# EAGLE design 6N137 (EAGLE 6.5.0)
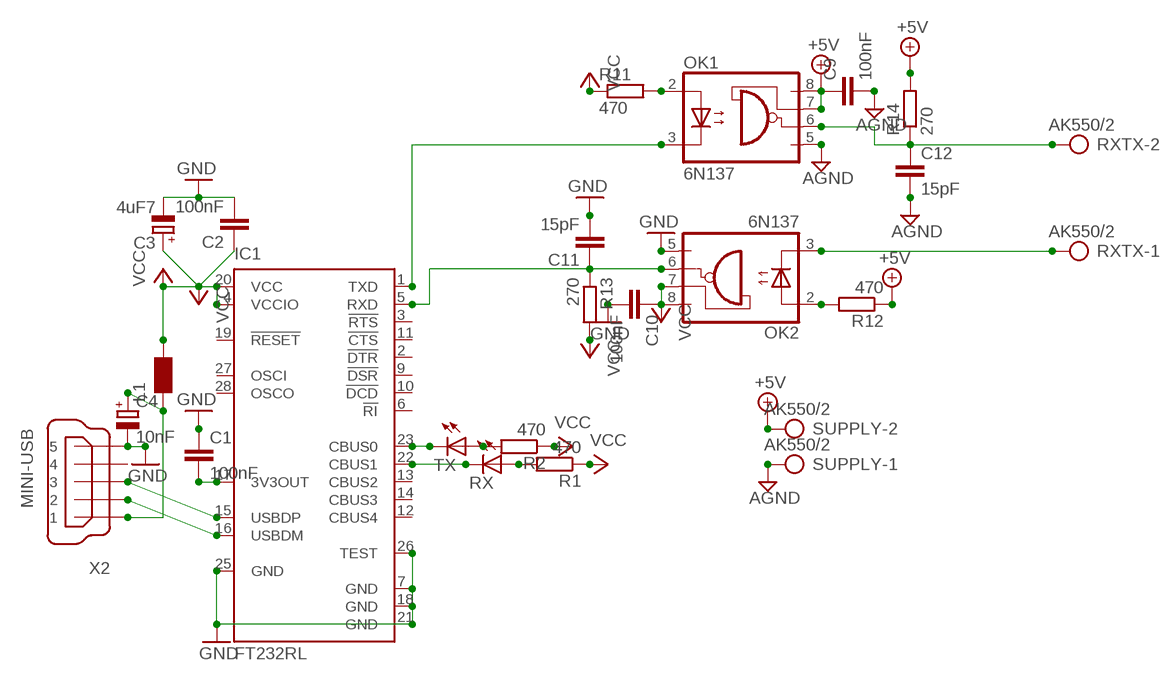
[diagram p0: schematic, sheet 1]

## Parts
C1  100nF  C-EUC1206K  [C1206K]
C2  100nF  C-EUC1206K  [C1206K]
C3  4uF7  CPOL-EU153CLV-0605  [153CLV-0605]
C4  10nF  CPOL-EU153CLV-0405  [153CLV-0405]
C9  100nF  C-EUC1206  [C1206]
C10  100nF  C-EUC1206  [C1206]
C11  15pF  C-EUC1206  [C1206]
C12  15pF  C-EUC1206  [C1206]
IC1  FT232RL  [SSOP28]
L1  WE-CBF_1206  [1206]
OK1  6N137  [DIL08]
OK2  6N137  [DIL08]
R1  470  R-EU_M1206  [M1206]
R2  470  R-EU_M1206  [M1206]
R11  470  R-EU_R1206  [R1206]
R12  470  R-EU_R1206  [R1206]
R13  270  R-EU_R1206  [R1206]
R14  270  R-EU_R1206  [R1206]
RX  LEDCHIPLED_1206  [CHIPLED_1206]
RXTX  AK550/2  [AK550/2]
SUPPLY  AK550/2  [AK550/2]
TX  LEDCHIPLED_1206  [CHIPLED_1206]
X2  MINI-USB  MINI-USB-SHIELD-UX60A-MB-5ST  [UX60A-MB-5ST]

## Nets
+5V: C9.1 OK1.7(VE) OK1.8(VCC) R12.1 R14.2 SUPPLY.2
AGND: C9.2 C12.2 OK1.5(GND) SUPPLY.1
FT_RXD1: C12.1 OK1.6(VO) R14.1 RXTX.2
FT_TXD1: OK2.3(C) RXTX.1
GND: C1.1 C2.2 C3.- C4.- C10.2 C11.2 IC1.7(GND) IC1.18(GND) IC1.21(GND) IC1.25(GND) IC1.26(TEST) OK2.5(GND) X2.5
N$1: IC1.16(USBDM) X2.2
N$2: IC1.15(USBDP) X2.3
N$3: R2.2 TX.A
N$5: C1.2 IC1.17(3V3OUT)
N$6: R1.2 RX.A
N$7: IC1.23(CBUS0) TX.C
N$8: IC1.22(CBUS1) RX.C
N$13: OK1.2(A) R11.2
N$16: OK2.2(A) R12.2
RXD1: C11.1 IC1.5(RXD) OK2.6(VO) R13.1
TXD1: IC1.1(TXD) OK1.3(C)
VBUS: C4.+ L1.1 X2.1
VCC: C2.1 C3.+ C10.1 IC1.4(VCCIO) IC1.20(VCC) L1.2 OK2.7(VE) OK2.8(VCC) R1.1 R2.1 R11.1 R13.2
Unconnected: IC1.2(!DTR) IC1.3(!RTS) IC1.6(!RI) IC1.9(!DSR) IC1.10(!DCD) IC1.11(!CTS) IC1.12(CBUS4) IC1.13(CBUS2) IC1.14(CBUS3) IC1.19(!RESET) IC1.27(OSCI) IC1.28(OSCO) X2.4 X2.M1(S1) X2.M2(S2) X2.M3(S3) X2.M4(S4)

## Library data of the parts
C1 C2 C9-C12 = rcl:C-EU: CAPACITOR, European symbol
C3 C4 = rcl:CPOL-EU: POLARIZED CAPACITOR, European symbol
IC1 = ftdichip:FT232R: Source: http://www.ftdichip.com/Documents/DataSheets/DS_FT232R_v104.pdf
L1 = wuerth-elektronik:WE-CBF: SMD EMI Suppression Ferrite Beads - excellent anti-EMI properties - low DCR - impedances till 3000 ohms - rated current up to 6 A
OK1 OK2 = optocoupler:6N137: MOTOROLA OPTO COUPLER; MPN: 6N137; OC_FARNELL: 1328376; OC_NEWARK: 52M1895
R1 R2 = resistor:R-EU_: RESISTOR, European symbol
R11-R14 = rcl:R-EU_: RESISTOR, European symbol
RX TX = led:LED: LED OSRAM: - CHIPLED LG R971, LG N971, LY N971, LG Q971, LY Q971, LO R971, LY R971 LH N974, LH R974 LS Q976, LO Q976, LY Q976 LO Q996 - Hyper CHIPLED LW Q18S LB Q993, LB Q99A, LB R99A - SideLED LS A670, LO A670, LY A670, LG A670, LP A670 LB A673, LV A673, LT A673, LW A673 LH A674 LY A675 LS A676, LA A676, LO A676, LY A676, LW A676 LS A679, LY A679, LG A679 - Hyper Micro SIDELED® LS Y876, LA Y876, LO Y876, LY Y876 LT Y87S - SmartLED LW L88C, LW L88S LB L89C, LB L89S, LG L890 LS L89K, LO L89K, LY L89K LS L896, LA L896, LO L896, LY L896 - TOPLED LS T670, LO T670, LY T670, LG T670, LP T670 LSG T670, LSP T670, LSY T670, LOP T670, LYG T670 LG T671, LOG T671, LSG T671 LB T673, LV T673, LT T673, LW T673 LH T674 LS T676, LA T676, LO T676, LY T676, LB T676, LH T676, LSB T676, LW T676 LB T67C, LV T67C, LT T67C, LS T67K, LO T67K, LY T67K, LW E67C LS E67B, LA E67B, LO E67B, LY E67B, LB E67C, LV E67C, LT E67C LW T67C LS T679, LY T679, LG T679 LS T770, LO T770, LY T770, LG T770, LP T770 LB T773, LV T773, LT T773, LW T773 LH T774 LS E675, LA E675, LY E675, LS T675 LS T776, LA T776, LO T776, LY T776, LB T776 LHGB T686 LT T68C, LB T68C - Hyper Mini TOPLED® LB M676 - Mini TOPLED Santana® LG M470 LS M47K, LO M47K, LY M47K Source: http://www.osram.convergy.de - LUMILED® LXK2-PW12-R00, LXK2-PW12-S00, LXK2-PW14-U00, LXK2-PW14-V00 LXK2-PM12-R00, LXK2-PM12-S00, LXK2-PM14-U00 LXK2-PE12-Q00, LXK2-PE12-R00, LXK2-PE12-S00, LXK2-PE14-T00, LXK2-PE14-U00 LXK2-PB12-K00, LXK2-PB12-L00, LXK2-PB12-M00, LXK2-PB14-N00, LXK2-PB14-P00, LXK2-PB14-Q00 LXK2-PR12-L00, LXK2-PR12-M00, LXK2-PR14-Q00, LXK2-PR14-R00 LXK2-PD12-Q00, LXK2-PD12-R00, LXK2-PD12-S00 LXK2-PH12-R00, LXK2-PH12-S00 LXK2-PL12-P00, LXK2-PL12-Q00, LXK2-PL12-R00 Source: www.luxeon.com
RXTX SUPPLY = con-ptr500:AK550/2: CONNECTOR
X2 = con-hirose:MINI-USB-SHIELD-: MINI USB Connector Source: http://www.hirose.co.jp/cataloge_hp/e24000019.pdf

## Board
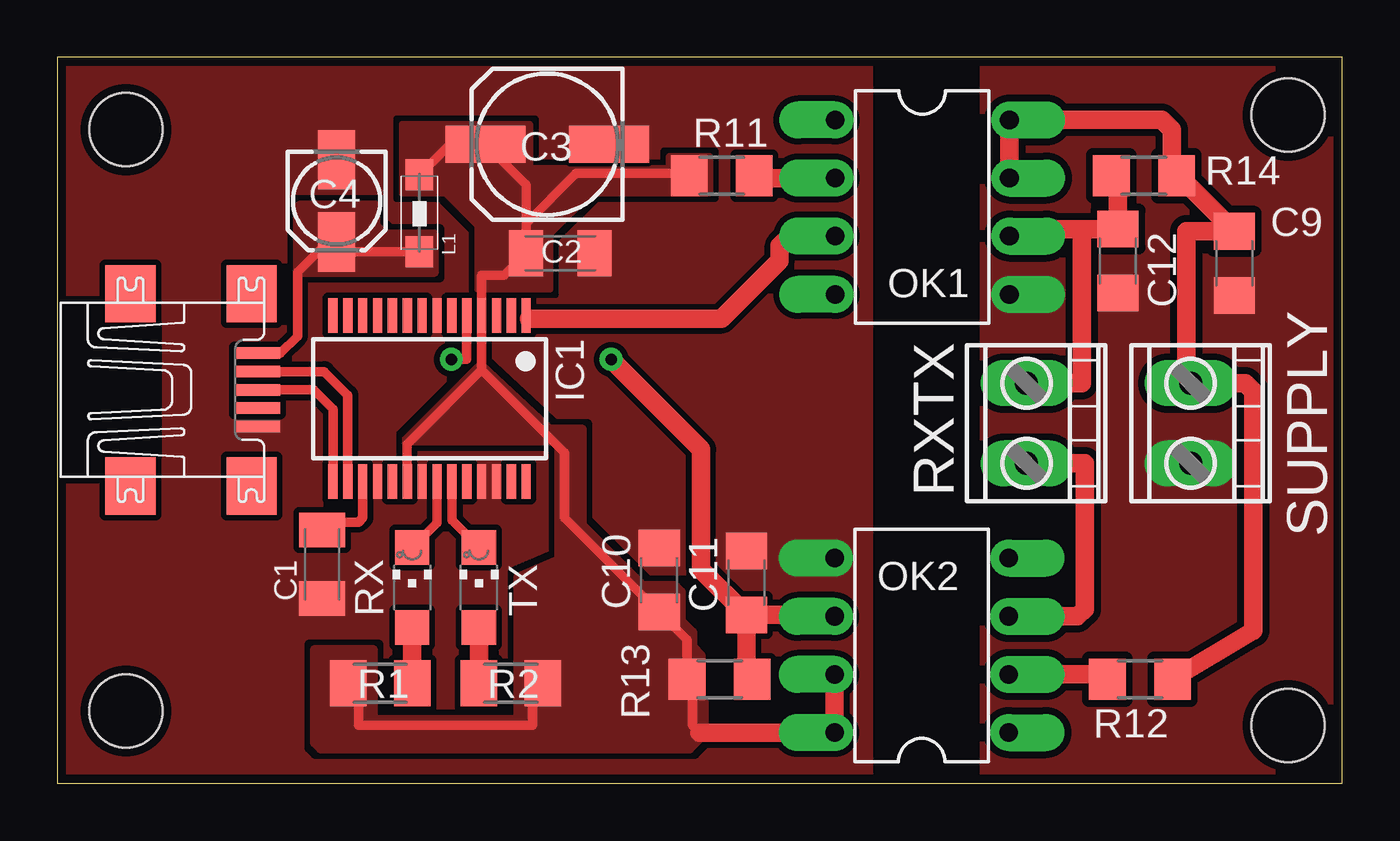
[diagram p1: board, top side]
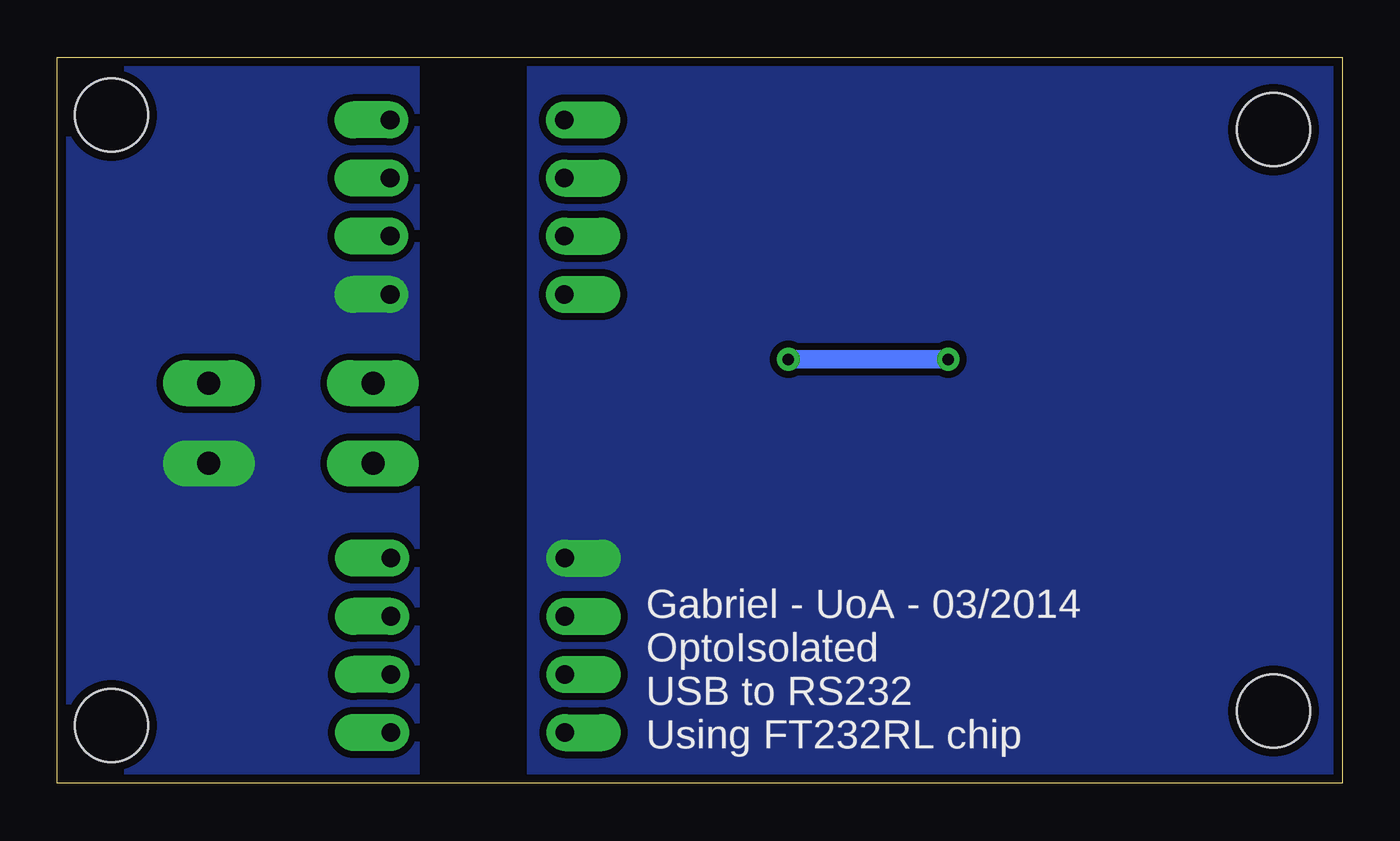
[diagram p2: board, bottom side, seen from below]

Size 56.19 x 31.74 mm. Coordinates in mm from the lower left corner, seen from the top.
Outline: 0,0 56.19,0 56.19,31.74 0,31.74 0,0
Copper layers (1*16): Top 0.0356mm / dielectric 1.5011mm / Bottom 0.0356mm
Design rules "LaenPCBOrder": minimum track width 6mil, minimum drill 13mil, track to track 6mil, track to pad 6mil, pad to pad 6mil, via to via 6mil, smd to smd 6mil, copper to edge 15mil, drill to drill 6mil, minimum pad ring 7mil, minimum via ring 7mil, stop-mask expansion 3mil, vias tented up to drill 0mil, thermal gap 10mil
Holes 3.2 mm at 53.81,29.2 53.81,2.54 3.01,3.17 3.01,28.57

### Footprints (pad centres in the part's own frame; a part is rotated, then mirrored left to right if it is on the bottom)
C1206K = smd 1.5 x 2: 1 -1.5,0; 2 1.5,0
153CLV-0605 = smd 3.5 x 1.6: + 2.7,0; - -2.7,0
153CLV-0405 = smd 2.6 x 1.6: + 1.8,0; - -1.8,0
C1206 = smd 1.6 x 1.8: 1 -1.4,0; 2 1.4,0
SSOP28 = smd 0.4 x 1.5: 1 -4.225,-3.625; 2 -3.575,-3.625; 3 -2.925,-3.625; 4 -2.275,-3.625; 5 -1.625,-3.625; 6 -0.975,-3.625; 7 -0.325,-3.625; 8 0.325,-3.625; 9 0.975,-3.625; 10 1.625,-3.625; 11 2.275,-3.625; 12 2.925,-3.625; 13 3.575,-3.625; 14 4.225,-3.625; 15 4.225,3.625; 16 3.575,3.625; 17 2.925,3.625; 18 2.275,3.625; 19 1.625,3.625; 20 0.975,3.625; 21 0.325,3.625; 22 -0.325,3.625; 23 -0.975,3.625; 24 -1.625,3.625; 25 -2.275,3.625; 26 -2.925,3.625; 27 -3.575,3.625; 28 -4.225,3.625
1206 = smd 1.35 x 1.2: 1 -1.7,0; 2 1.65,0
DIL08 = drill 0.813 offset: 1 -3.81,-3.81; 2 -1.27,-3.81; 3 1.27,-3.81; 4 3.81,-3.81; 5 3.81,3.81; 6 1.27,3.81; 7 -1.27,3.81; 8 -3.81,3.81
M1206 = smd 1.6 x 2: 1 -1.4,0; 2 1.4,0
R1206 = smd 1.6 x 1.803: 1 -1.422,0; 2 1.422,0
CHIPLED_1206 = smd 1.5 x 1.5: A 0,-1.75; C 0,1.75
AK550/2 = drill 1 pad 1.5 long: 1 -1.75,0; 2 1.75,0
UX60A-MB-5ST = smd 2 x 0.5: 1 2.25,1.6; 2 2.25,0.8; 3 2.25,0; 4 2.25,-0.8; 5 2.25,-1.6 | smd 2.2 x 2.5: M1 -3.3,-4.2; M2 -3.3,4.2; M3 2,4.2; M4 2,-4.2

### Placement (x,y rotation side)
C1  11.58,9.58 90 top
C2  22,23.17 0 top
C3  21.42,27.93 180 top
C4  12.22,25.46 270 top
C9  51.46,22.73 270 top
C10  26.32,8.89 90 top
C11  30.13,8.77 90 top
C12  46.38,22.83 270 top
IC1  16.28,16.82 180 top
L1  15.84,24.95 90 top
OK1  37.82,25.19 270 top
OK2  37.8,6.04 90 top
R1  14.12,4.38 0 top
R2  19.84,4.38 180 top
R11  29.06,26.55 0 top
R12  47.34,4.55 180 top
R13  28.96,4.55 180 top
R14  47.51,26.55 0 top
RX  15.52,8.57 0 top
RXTX  42.38,15.74 90 top
SUPPLY  49.56,15.74 90 top
TX  18.44,8.57 0 top
X2  6.5,17.2 0 top

### Tracks (layer width: path | path; a pad name or v marks a point on that pad's centre or on a via)
+5V
  Top 0.406: 49.03,26.55 R14.2 48.73,26.76 | SUPPLY.2 49.37,17.68 | 49.37,24.12 49.37,24.13
  Top 0.813: OK1.7 OK1.8 48.3,29 48.73,28.57 48.73,26.76 | 49.03,26.55 C9.1 49.37,24.13 | 49.37,17.68 49.37,24.12 | R12.1 52.29,6.68 52.29,17.14 51.93,17.49 SUPPLY.2
AGND
  pour Top (isolate 0.305, no thermals): 55.97,31.49 40.48,31.62 40.48,0.38 55.97,0.25
  pour Bottom (isolate 0.305, no thermals): 40.48,31.62 55.97,31.49 55.97,0.12 40.48,0.38
FT_RXD1
  Top 0.406: R14.1 46.38,26.27
  Top 0.813: 46.38,26.27 C12.1 44.79,24.23 | OK1.6 41.95,24.23 44.79,24.23 | RXTX.2 44.79,17.49 44.79,24.23
FT_TXD1
  Top 0.813: RXTX.1 44.92,13.99 44.92,7.62 44.61,7.31 OK2.3
GND
  pour Top (isolate 0.254, rank 2, no thermals): 0.09,31.62 35.52,31.62 35.52,0.38 0.09,0.38
  pour Bottom (isolate 0.305, no thermals): 0.09,31.49 35.52,31.49 35.52,0.25 0.09,0.25
N$1
  Top 0.406: X2.2 11.67,18 12.71,16.97 IC1.16
N$2
  Top 0.406: X2.3 11.2,17.2 12.06,16.35 IC1.15
N$3
  Top 0.406: R2.2
  Top 0.813: TX.A R2.2
N$5
  Top 0.406: IC1.17 13.36,11.61 13.17,11.43 11.92,11.43 C1.2
N$6
  Top 0.406: R1.2
  Top 0.813: RX.A R1.2
N$7
  Top 0.406: IC1.23 17.26,11.5 TX.C
N$8
  Top 0.406: IC1.22 16.61,11.4 RX.C
N$13
  Top 0.406: R11.2 30.58,26.46
  Top 0.813: 30.58,26.46 OK1.2
N$16
  Top 0.406: R12.2 45.7,4.77
  Top 0.813: 45.7,4.77 OK2.2
RXD1  (via drill 0.5 pad 0.81)
  Top 0.406: OK2.6 34.18,7.37 | R13.1 30.13,4.8 | v17.23,18.54 17.91,18.54 IC1.5
  Top 0.813: 34.18,7.37 C11.1 | 30.13,4.8 C11.1 | C11.1 28.16,9.34 28.16,14.6 v24.22,18.54
  Bottom 0.813: v24.22,18.54 v17.23,18.54
TXD1
  Top 0.406: IC1.1 20.64,20.31
  Top 0.813: 20.64,20.31 29.04,20.31 31.58,22.86 31.58,23.49 32.01,23.92 OK1.3
VBUS
  Top 0.406: L1.1 12.63,23.25 C4.+ 11.82,23.66 10.5,22.35 10.5,19.55 9.75,18.8 X2.1
  pour Top (no thermals): 10.5,22.35 16.47,22.35 16.47,24 14.31,24 13.93,24.38 13.93,25.27 10.63,25.27 10.5,25.14
VCC
  Top 0.406: 28.08,2.23 27.77,2.54 27.77,4.31 R13.2 27.54,6.27 C10.1 22.19,11.62 22.19,14.45 18.56,18.08 | R1.1 13.17,3.93 13.17,2.54 20.79,2.54 20.79,4.44 20.85,4.38 R2.1 | L1.2 17.18,27.93 C3.+ 20.5,26.16 C2.1 | C2.1 19.54,22.22 18.56,22.22 IC1.4 18.56,18.08 | R11.1 27.53,26.66 22.7,26.66 20.5,24.47 C2.1 | IC1.20 15.31,14.83 18.56,18.08
  Top 0.813: OK2.7 OK2.8 28.08,2.23
  pour Top (no thermals): 15.08,28.82 20.66,28.82 20.66,26.92 26.76,26.92 26.76,27.43 28.54,27.43 28.54,25.78 23.33,25.78 21.55,24 21.55,21.58 18.38,21.58 18.38,24.38 16.98,25.78 15.08,25.78
  pour Top: 18.5,18.28 15.2,14.98 22.06,14.98
  pour Top (no thermals): 21.55,15.49 22.95,15.49 22.95,11.3 25.62,8.63 27.01,8.63 27.27,8.38 27.27,7.11 27.77,6.6 27.77,5.96 28.16,5.58 28.16,3.17 26.5,3.17 26.5,5.58 26.25,5.58 21.93,9.9 21.93,15.24
  pour Top (no thermals): 11.27,5.84 11.27,1.77 11.52,1.52 27.65,1.52 28.28,2.15 28.28,3.55 22.7,9.01 21.93,9.77 20.15,9.01 20.15,2.79 13.81,2.79 13.81,5.84

### Text on the board
bNames: Gabriel - UoA - 03/2014 / OptoIsolated / USB to RS232 / Using FT232RL chip